# EAGLE design ai_hub_usb (EAGLE 6.5.0)
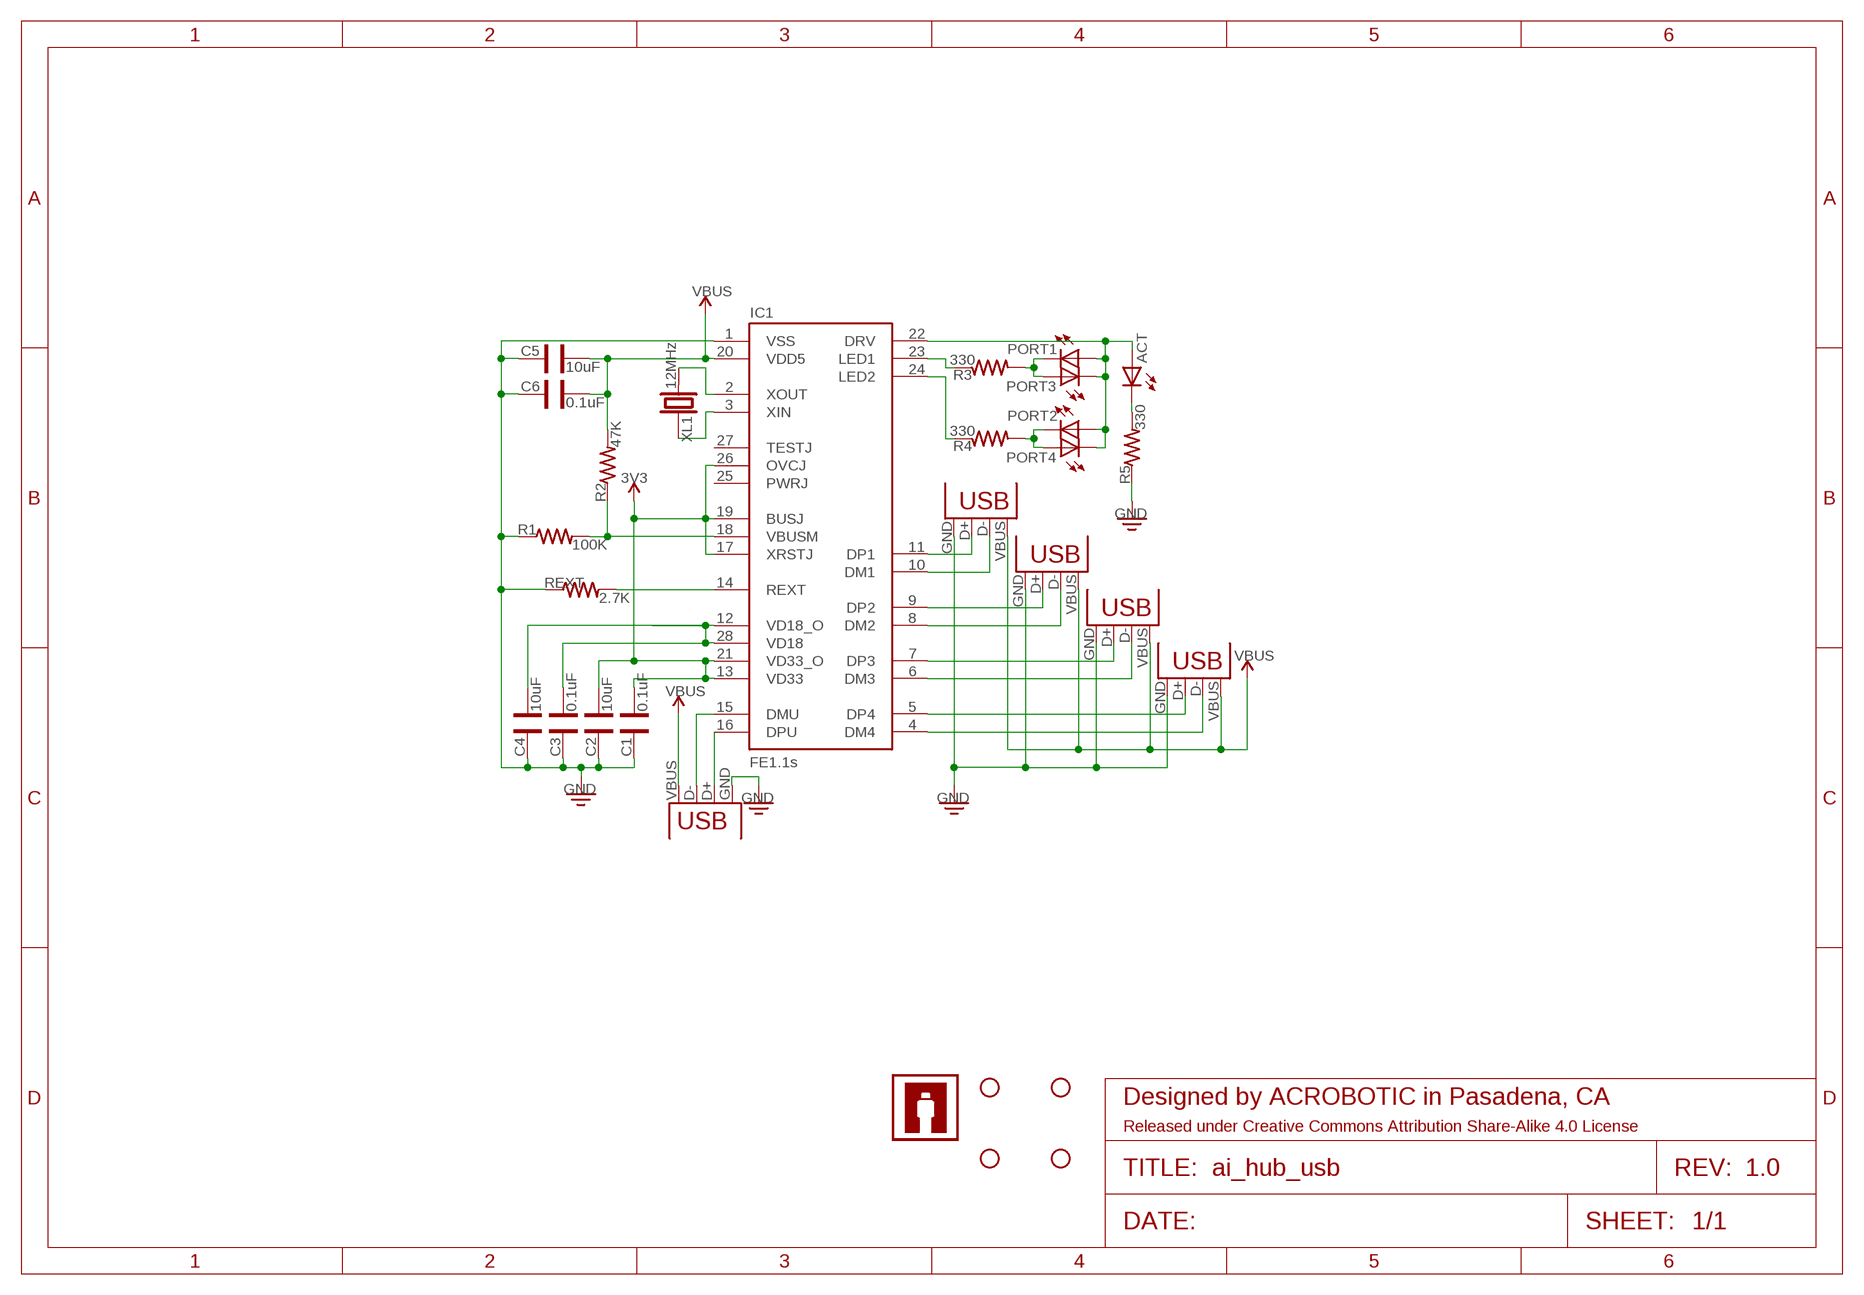
[diagram p0: schematic, sheet 1]

## Parts
ACT  LED0603  [LED-0603]
C1  0.1uF  CAP0603  [CAP-0603]
C2  10uF  CAP0603  [CAP-0603]
C3  0.1uF  CAP0603  [CAP-0603]
C4  10uF  CAP0603  [CAP-0603]
C5  10uF  CAP0603  [CAP-0603]
C6  0.1uF  CAP0603  [CAP-0603]
FRAME1  FRAME-LETTER  [CREATIVE-COMMONS]
IC1  FE1.1S  [FE1.1S_SSOP-28]
PORT1  LED0603  [LED-0603]
PORT2  LED0603  [LED-0603]
PORT3  LED0603  [LED-0603]
PORT4  LED0603  [LED-0603]
R1  100K  RES0603  [RES-0603]
R2  47K  RES0603  [RES-0603]
R3  330  RES0603  [RES-0603]
R4  330  RES0603  [RES-0603]
R5  330  RES0603  [RES-0603]
REXT  2.7K  RES0603  [RES-0603]
STANDOFF1  STAND-OFF4  [STAND-OFF-4]
STANDOFF2  STAND-OFF4  [STAND-OFF-4]
STANDOFF3  STAND-OFF4  [STAND-OFF-4]
STANDOFF4  STAND-OFF4  [STAND-OFF-4]
U$5  AI-LOGOXS  [AI-LOGO-XS]
U$6  AI-LOGOXS  [AI-LOGO-XS]
USB1  USBMICROB-PTH  [USB-MICROB-TH]
USB2  USBA-PTH  [USB-A-F-PTH]
USB3  USBA-PTH  [USB-A-F-PTH]
USB4  USBA-PTH  [USB-A-F-PTH]
USB5  USBA-PTH  [USB-A-F-PTH]
XL1  12MHz  CRYSTALHC49UP  [HC49UP]

## Nets
3V3: C1.1 C2.1 IC1.13(VD33) IC1.17(XRSTJ) IC1.19(BUSJ) IC1.21(VD33_O) IC1.26(OVCJ)
GND: C1.2 C2.2 C3.2 C4.2 C5.2 C6.2 IC1.1(VSS) R1.1 R5.1 REXT.1 USB1.GND USB2.GND USB3.GND USB4.GND USB5.GND
N$1: IC1.14(REXT) REXT.2
N$2: IC1.15(DMU) USB1.D-
N$3: IC1.16(DPU) USB1.D+
N$6: PORT2.C PORT4.A R4.2
N$7: IC1.2(XOUT) XL1.2
N$8: C3.1 C4.1 IC1.12(VD18_O) IC1.28(VD18)
N$9: IC1.3(XIN) XL1.1
N$11: IC1.11(DP1) USB5.D+
N$12: IC1.10(DM1) USB5.D-
N$13: IC1.18(VBUSM) R1.2 R2.1
N$14: IC1.9(DP2) USB4.D+
N$15: IC1.8(DM2) USB4.D-
N$16: IC1.7(DP3) USB3.D+
N$17: IC1.6(DM3) USB3.D-
N$18: IC1.5(DP4) USB2.D+
N$19: IC1.4(DM4) USB2.D-
N$20: PORT1.C PORT3.A R3.2
N$22: ACT.C R5.2
N$23: IC1.23(LED1) R3.1
N$24: IC1.24(LED2) R4.1
N$25: ACT.A IC1.22(DRV) PORT1.A PORT2.A PORT3.C PORT4.C
VBUS: C5.1 C6.1 IC1.20(VDD5) R2.2 USB1.VBUS USB2.VBUS USB3.VBUS USB4.VBUS USB5.VBUS
Unconnected: IC1.25(PWRJ) IC1.27(TESTJ)

## Library data of the parts
ACT PORT1-PORT4 = Ai_LED:LED
C1-C6 = Ai_Passives:CAP
FRAME1 = Ai_Miscellany:FRAME-LETTER: Schematic Frame A4 (8.5x11) US Letter frame based on the built-in A4-LOC frame.; REV: 1.0
IC1 = Ai_IC:FE1.1S
R1-R5 REXT = Ai_Passives:RES: Part # blah Digikey
STANDOFF1-STANDOFF4 = Ai_Electromechanical:STAND-OFF: Size #4
U$5 U$6 = Ai_Miscellany:AI-LOGO
USB1-USB5 = Ai_Connectors:USB
XL1 = Ai_FrequencyControl:CRYSTAL: PTH: ... SMD: ... Cylinder: CMR200T-32.768KDZBT

## Board
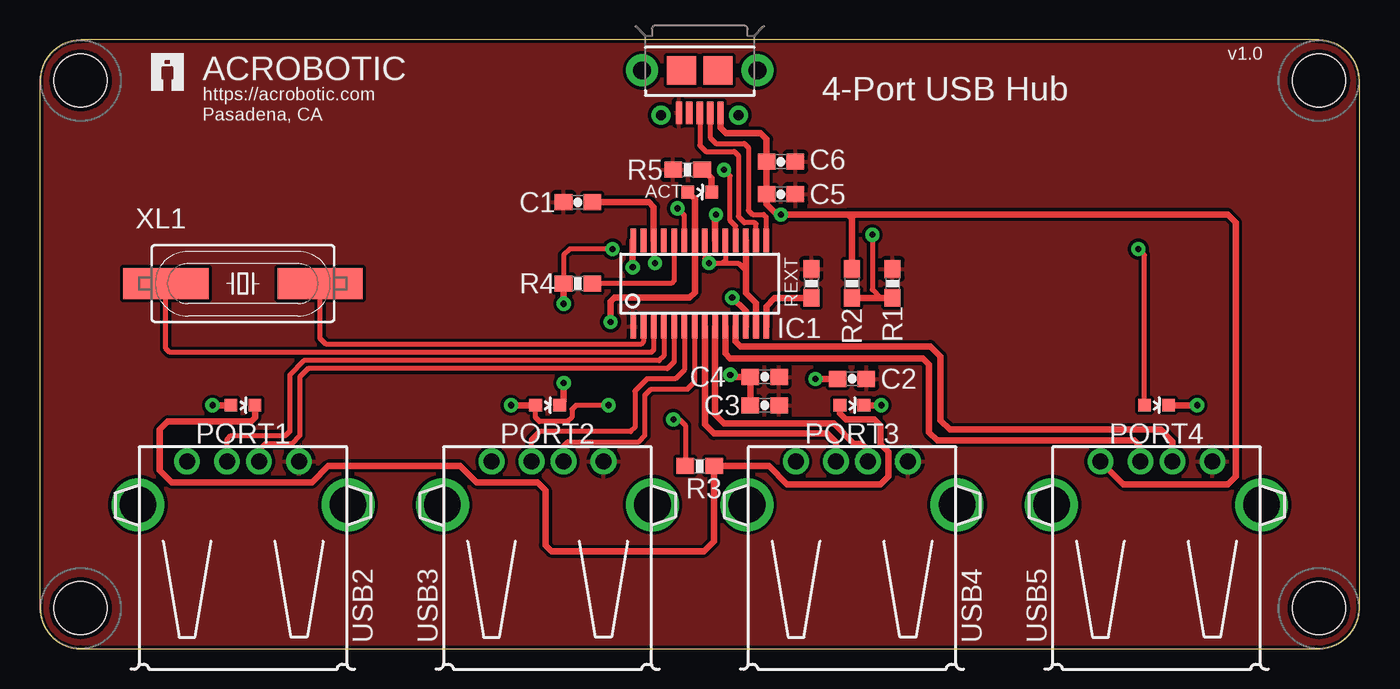
[diagram p1: board, top side]
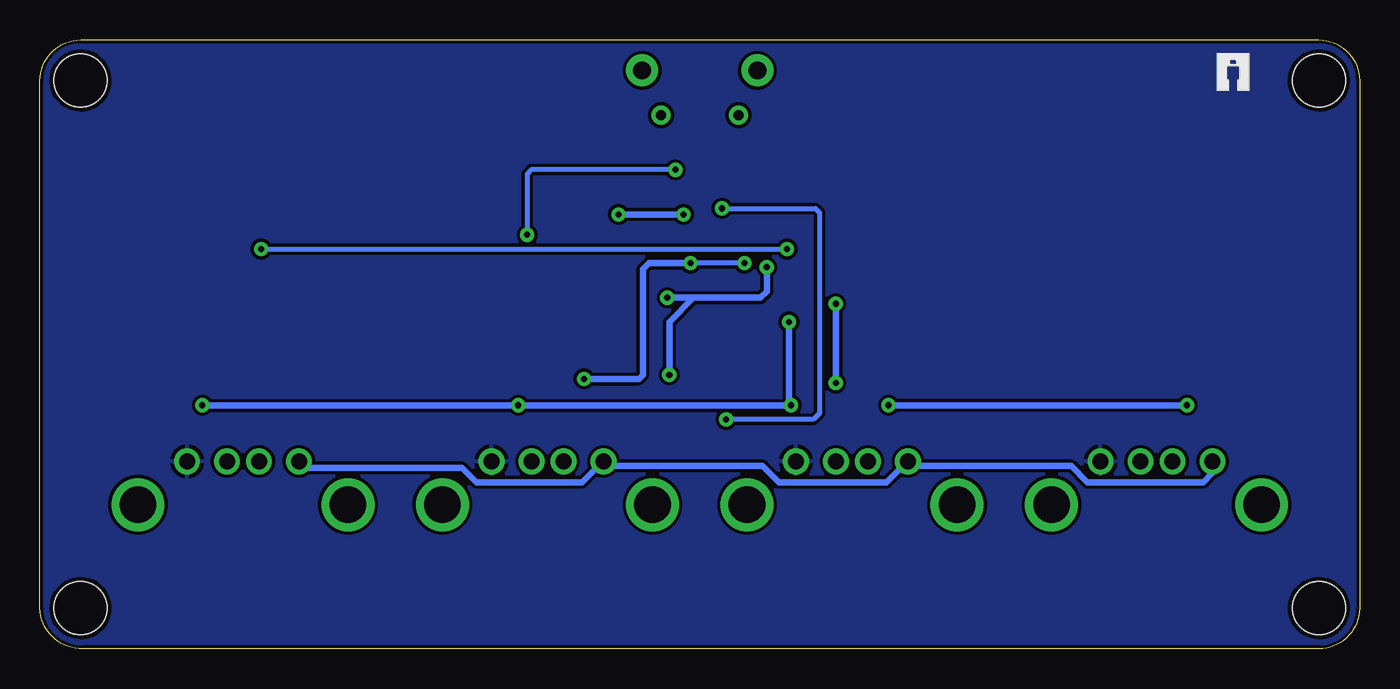
[diagram p2: board, bottom side, seen from below]

Size 82.55 x 38.1 mm. Coordinates in mm from the lower left corner, seen from the top.
Outline: 0,35.56 0,2.54 arc90 2.54,0 79.86,0 arc90 82.55,2.54 82.55,35.56 arc90 80.01,38.1 2.54,38.1 arc90 0,35.56
Copper layers (1*16): Top 0.035mm / dielectric 1.5mm / Bottom 0.035mm
Design rules "ai_2layer": minimum track width 7mil, minimum drill 15mil, track to track 8mil, track to pad 8mil, pad to pad 8mil, via to via 8mil, smd to smd 8mil, copper to edge 8mil, drill to drill 8mil, minimum pad ring 12mil, minimum via ring 10mil, stop-mask expansion 4mil, vias tented up to drill 20mil, thermal gap 10mil

### Footprints (pad centres in the part's own frame; a part is rotated, then mirrored left to right if it is on the bottom)
LED-0603 = smd 0.8 x 0.8: A 0,-0.75; C 0,0.75
CAP-0603 = smd 1.1 x 1: 1 -0.9,0; 2 0.9,0
FE1.1S_SSOP-28 = smd 0.35 x 1.5: 1 -4.16,-2.7; 2 -3.52,-2.7; 3 -2.88,-2.7; 4 -2.24,-2.7; 5 -1.6,-2.7; 6 -0.96,-2.7; 7 -0.32,-2.7; 8 0.32,-2.7; 9 0.96,-2.7; 10 1.6,-2.7; 11 2.24,-2.7; 12 2.88,-2.7; 13 3.52,-2.7; 14 4.16,-2.7; 15 4.16,2.7; 16 3.52,2.7; 17 2.88,2.7; 18 2.24,2.7; 19 1.6,2.7; 20 0.96,2.7; 21 0.32,2.7; 22 -0.3,2.7; 23 -0.96,2.7; 24 -1.6,2.7; 25 -2.24,2.7; 26 -2.88,2.7; 27 -3.52,2.7; 28 -4.16,2.7
RES-0603 = smd 1.1 x 1: 1 -0.9,0; 2 0.9,0
STAND-OFF-4 = hole 3.302: 0,0
USB-MICROB-TH = smd 0.4 x 1.4: D+ 0,2.65; D- -0.65,2.65; GND 1.3,2.65; ID 0.65,2.65; VBUS -1.3,2.65 | smd 1.8 x 1.8: M5 -1.15,0; M6 1.15,0 | drill 0.6 pad 1.2: MT1 -2.425,2.8; MT2 2.425,2.8 | drill 1.1 pad 2: MT3 -3.61,0; MT4 3.61,0
USB-A-F-PTH = drill 1: D+ 1,5.37; D- -1,5.37; GND 3.5,5.37; VBUS -3.5,5.37 | drill 2.286: P$1 -6.57,2.66; P$2 6.57,2.66
HC49UP = smd 5.334 x 1.93: 1 -4.826,0; 2 4.826,0

### Placement (x,y rotation side)
ACT  41.27,28.57 270 top
C1  33.66,27.94 180 top
C2  50.8,16.89 0 top
C3  45.34,15.24 0 top
C4  45.34,17.02 0 top
C5  46.35,28.45 0 top
C6  46.35,30.48 0 top
FRAME1  41.27,-1.27 0 top
IC1  41.27,22.86 0 top
PORT1  12.7,15.24 270 top
PORT2  31.75,15.24 270 top
PORT3  50.8,15.24 270 top
PORT4  69.85,15.24 270 top
R1  53.34,22.86 270 top
R2  50.8,22.86 90 top
R3  41.27,11.43 0 top
R4  33.66,22.86 180 top
R5  40.51,29.97 0 top
REXT  48.26,22.86 270 top
STANDOFF1  2.54,35.56 0 top
STANDOFF2  2.54,2.54 0 top
STANDOFF3  80.01,2.54 0 top
STANDOFF4  80.01,35.56 0 top
U$5  8.89,34.92 0 bottom
U$6  6.99,34.92 0 top
USB1  41.27,36.2 180 top
USB2  12.7,6.35 0 top
USB3  31.75,6.35 0 top
USB4  50.8,6.35 0 top
USB5  69.85,6.35 0 top
XL1  12.7,22.86 0 top

### Tracks (layer width: path | path; a pad name or v marks a point on that pad's centre or on a via)
3V3  (via drill 0.38)
  Top 0.305: IC1.21 41.59,24.39 v41.86,24.13 42.7,24.13 | IC1.19 42.88,24.31 42.7,24.13 | 42.7,24.13 43.69,24.13 44.07,23.75 44.16,23.75 | IC1.26 38.4,24.22 v38.48,24.13
  Top 0.406: IC1.26 38.4,27.64 38.1,27.94 C1.1 | IC1.17 44.16,23.75 44.16,22.27 44.8,21.63 IC1.13 | C2.1 v48.51,16.89
  Bottom 0.305: v38.48,24.13 v41.86,24.13
  Bottom 0.406: v48.51,16.89 45.09,16.89 44.83,17.14 44.83,23.75 44.45,24.13 v41.86,24.13
GND
  pour Bottom: 0,0 82.55,0 82.55,38.1 0,38.1
  pour Top: 0,0 82.55,0 82.55,38.1 0,38.1
N$1
  Top 0.406: IC1.14 45.44,21.43 45.96,21.96 REXT.2
N$2
  Top 0.305: USB1.D- 41.92,31.99 42.29,31.62 44.07,31.62 44.32,31.37 44.32,27.43 44.58,27.18 45.28,27.18 45.44,27.02 IC1.15
N$3
  Top 0.305: USB1.D+ 41.27,31.5 41.66,31.11 43.43,31.11 43.69,30.86 43.69,27.05 44.07,26.67 44.7,26.67 44.8,26.58 IC1.16
N$6  (via drill 0.38)
  Top 0.254: R4.2
  Top 0.305: PORT4.A 69.1,24.63 v68.71,25.02 | v35.81,25.02 33.15,25.02 32.77,24.64 R4.2
  Top 0.406: v32.77,16.64 32.77,15.51 PORT2.C | v32.77,21.59 32.76,21.6 R4.2
  Bottom 0.305: v68.71,25.02 v35.81,25.02
  Bottom 0.406: v32.77,21.59 v32.77,16.64
N$7
  Top 0.305: IC1.2 37.76,19.21 37.59,19.05 17.91,19.05 17.53,19.43 XL1.2
N$8  (via drill 0.38)
  Top 0.406: IC1.12 44.16,21.12 v43.31,21.97 | v37.08,23.88 37.08,25.53 IC1.28 | C3.1 C4.1 43.31,17.02 v43.18,17.14
  Bottom 0.406: v43.31,21.97 41.66,21.97 | 41.66,21.97 37.47,21.97 37.08,22.35 v37.08,23.88 | v43.18,17.14 43.18,20.45 41.66,21.97
N$9
  Top 0.305: IC1.3 38.4,18.71 38.23,18.54 8.13,18.54 7.87,18.8 XL1.1
N$11
  Top 0.406: IC1.11 43.52,19.22 43.81,18.92 55.7,18.92 56.34,18.29 56.34,14.3 56.92,13.72 70.1,13.72 70.85,12.97 USB5.D+
N$12
  Top 0.406: USB5.D- 68.85,12.63 68.45,13.03 56.13,13.03 55.63,13.54 55.63,17.78 55.24,18.16 43.18,18.16 42.88,18.47 IC1.10
N$13  (via drill 0.38)
  Top 0.305: IC1.18 43.52,26.46 43.18,26.8 43.18,29.59 v42.8,29.97 | v52.07,25.91 52.07,22.47 52.58,21.96
  Top 0.406: R2.1 52.58,21.96 R1.2
  Bottom 0.305: v42.8,29.97 51.82,29.97 52.07,29.72 v52.07,25.91
N$14
  Top 0.406: IC1.9 42.23,14.66 42.8,14.1 49.66,14.1 50.93,12.83 51.44,12.83 51.8,12.46 USB4.D+
N$15
  Top 0.406: USB4.D- 49.8,12.94 49.28,13.46 42.16,13.46 41.59,14.03 IC1.8
N$16
  Top 0.305: USB3.D+ 32.75,12.68 33.02,12.95 37.47,12.95 37.85,13.34 37.85,15.88 38.23,16.26 40.51,16.26 40.95,16.7 IC1.7
N$17
  Top 0.305: IC1.6 40.31,17.45 39.75,16.89 37.97,16.89 37.21,16.13 37.21,13.84 36.96,13.59 31.24,13.59 30.73,13.08 30.73,11.74 USB3.D-
N$18
  Top 0.305: IC1.5 39.67,17.96 39.24,17.53 16.76,17.53 16.26,17.02 16.26,13.34 15.75,12.83 14.1,12.83 13.7,12.43 USB2.D+
N$19
  Top 0.305: IC1.4 39.03,18.33 38.73,18.03 16.51,18.03 15.62,17.14 15.62,13.59 15.37,13.34 11.94,13.34 11.7,13.1 USB2.D-
N$20
  Top 0.406: PORT1.C 13.46,15.23 13.46,14.48 13.21,14.22 8,14.22 7.49,13.72 7.49,11.18 8.26,10.41 17.02,10.41 18.03,11.43 26.29,11.43 27.3,10.41 31.11,10.41 31.62,9.91 31.62,6.48 32,6.1 41.53,6.1 42.16,6.73 R3.2 45.59,11.43 46.74,10.29 52.58,10.29 53.09,10.79 53.09,12.32 52.58,12.83 52.58,13.97 52.2,14.35 50.42,14.35 50.05,14.72 PORT3.A
N$22
  Top 0.406: ACT.C 42.02,29.44 R5.2
N$23  (via drill 0.38)
  Top 0.305: IC1.23 40.31,27.12 v39.88,27.56 | v39.62,14.35 39.99,14.35 40.38,13.97 R3.1
  Bottom 0.305: v39.88,27.56 34.04,27.56 33.78,27.3 33.78,14.73 34.16,14.35 v39.62,14.35
N$24
  Top 0.305: IC1.24 39.67,23.04 39.5,22.86 R4.1
N$25  (via drill 0.38)
  Top 0.305: v35.56,15.24 33.53,15.24 33.27,14.99 33.27,14.48 33.02,14.22 31.24,14.22 30.99,14.48 30.99,15.23 PORT2.A
  Top 0.406: ACT.A 40.98,28.12 IC1.22 40.98,22.31 40.64,21.97 35.94,21.97 35.69,21.72 v35.69,20.45 | PORT1.A v10.79,15.24 | v29.46,15.24 PORT2.A | PORT4.C v72.39,15.24 | PORT3.C v52.63,15.24
  Bottom 0.406: v10.79,15.24 v29.46,15.24 | v35.69,20.45 35.69,15.37 | 35.69,15.37 v35.56,15.24 | v72.39,15.24 v52.63,15.24 35.81,15.24 35.69,15.37
VBUS  (via drill 0.38)
  Top 0.406: USB1.VBUS 42.58,32.61 42.93,32.26 45.09,32.26 45.45,31.89 C6.1 C5.1 45.45,27.82 46.1,27.18 v46.35,27.18 50.55,27.18 | 50.55,27.18 50.8,26.92 R2.2 | IC1.20 42.23,27.12 v42.29,27.18 | USB5.VBUS 67.78,10.29 74.3,10.29 74.8,10.79 74.8,26.67 74.3,27.18 50.55,27.18
  Bottom 0.305: 65.93,11.3 USB5.VBUS
  Bottom 0.406: v42.29,27.18 v46.35,27.18 | USB2.VBUS 9.2,10.99 9.78,10.41 17.02,10.41 18.03,11.43 27.96,11.43 USB3.VBUS 29.14,10.87 29.59,10.41 36.32,10.41 37.34,11.43 47.01,11.43 USB4.VBUS 47.3,11.76 48.64,10.41 55.24,10.41 56.13,11.3 65.93,11.3

### Text on the board
tPlace: v1.0 | ACROBOTIC | https://acrobotic.com | 4-Port USB Hub | Pasadena, CA
tDocu: @MakerBro